# EasyEDA Pro project 声源放大输出(1).eprj

# Schematic Schematic1
Create Date: 2024-07-14; Page Name: P1; Project Name: 声源放大输出(1); Schematic Name: Schematic1; Update Date: 2024-07-15; Company: 嘉立创EDA; Page Size: A4; Version: V1.0
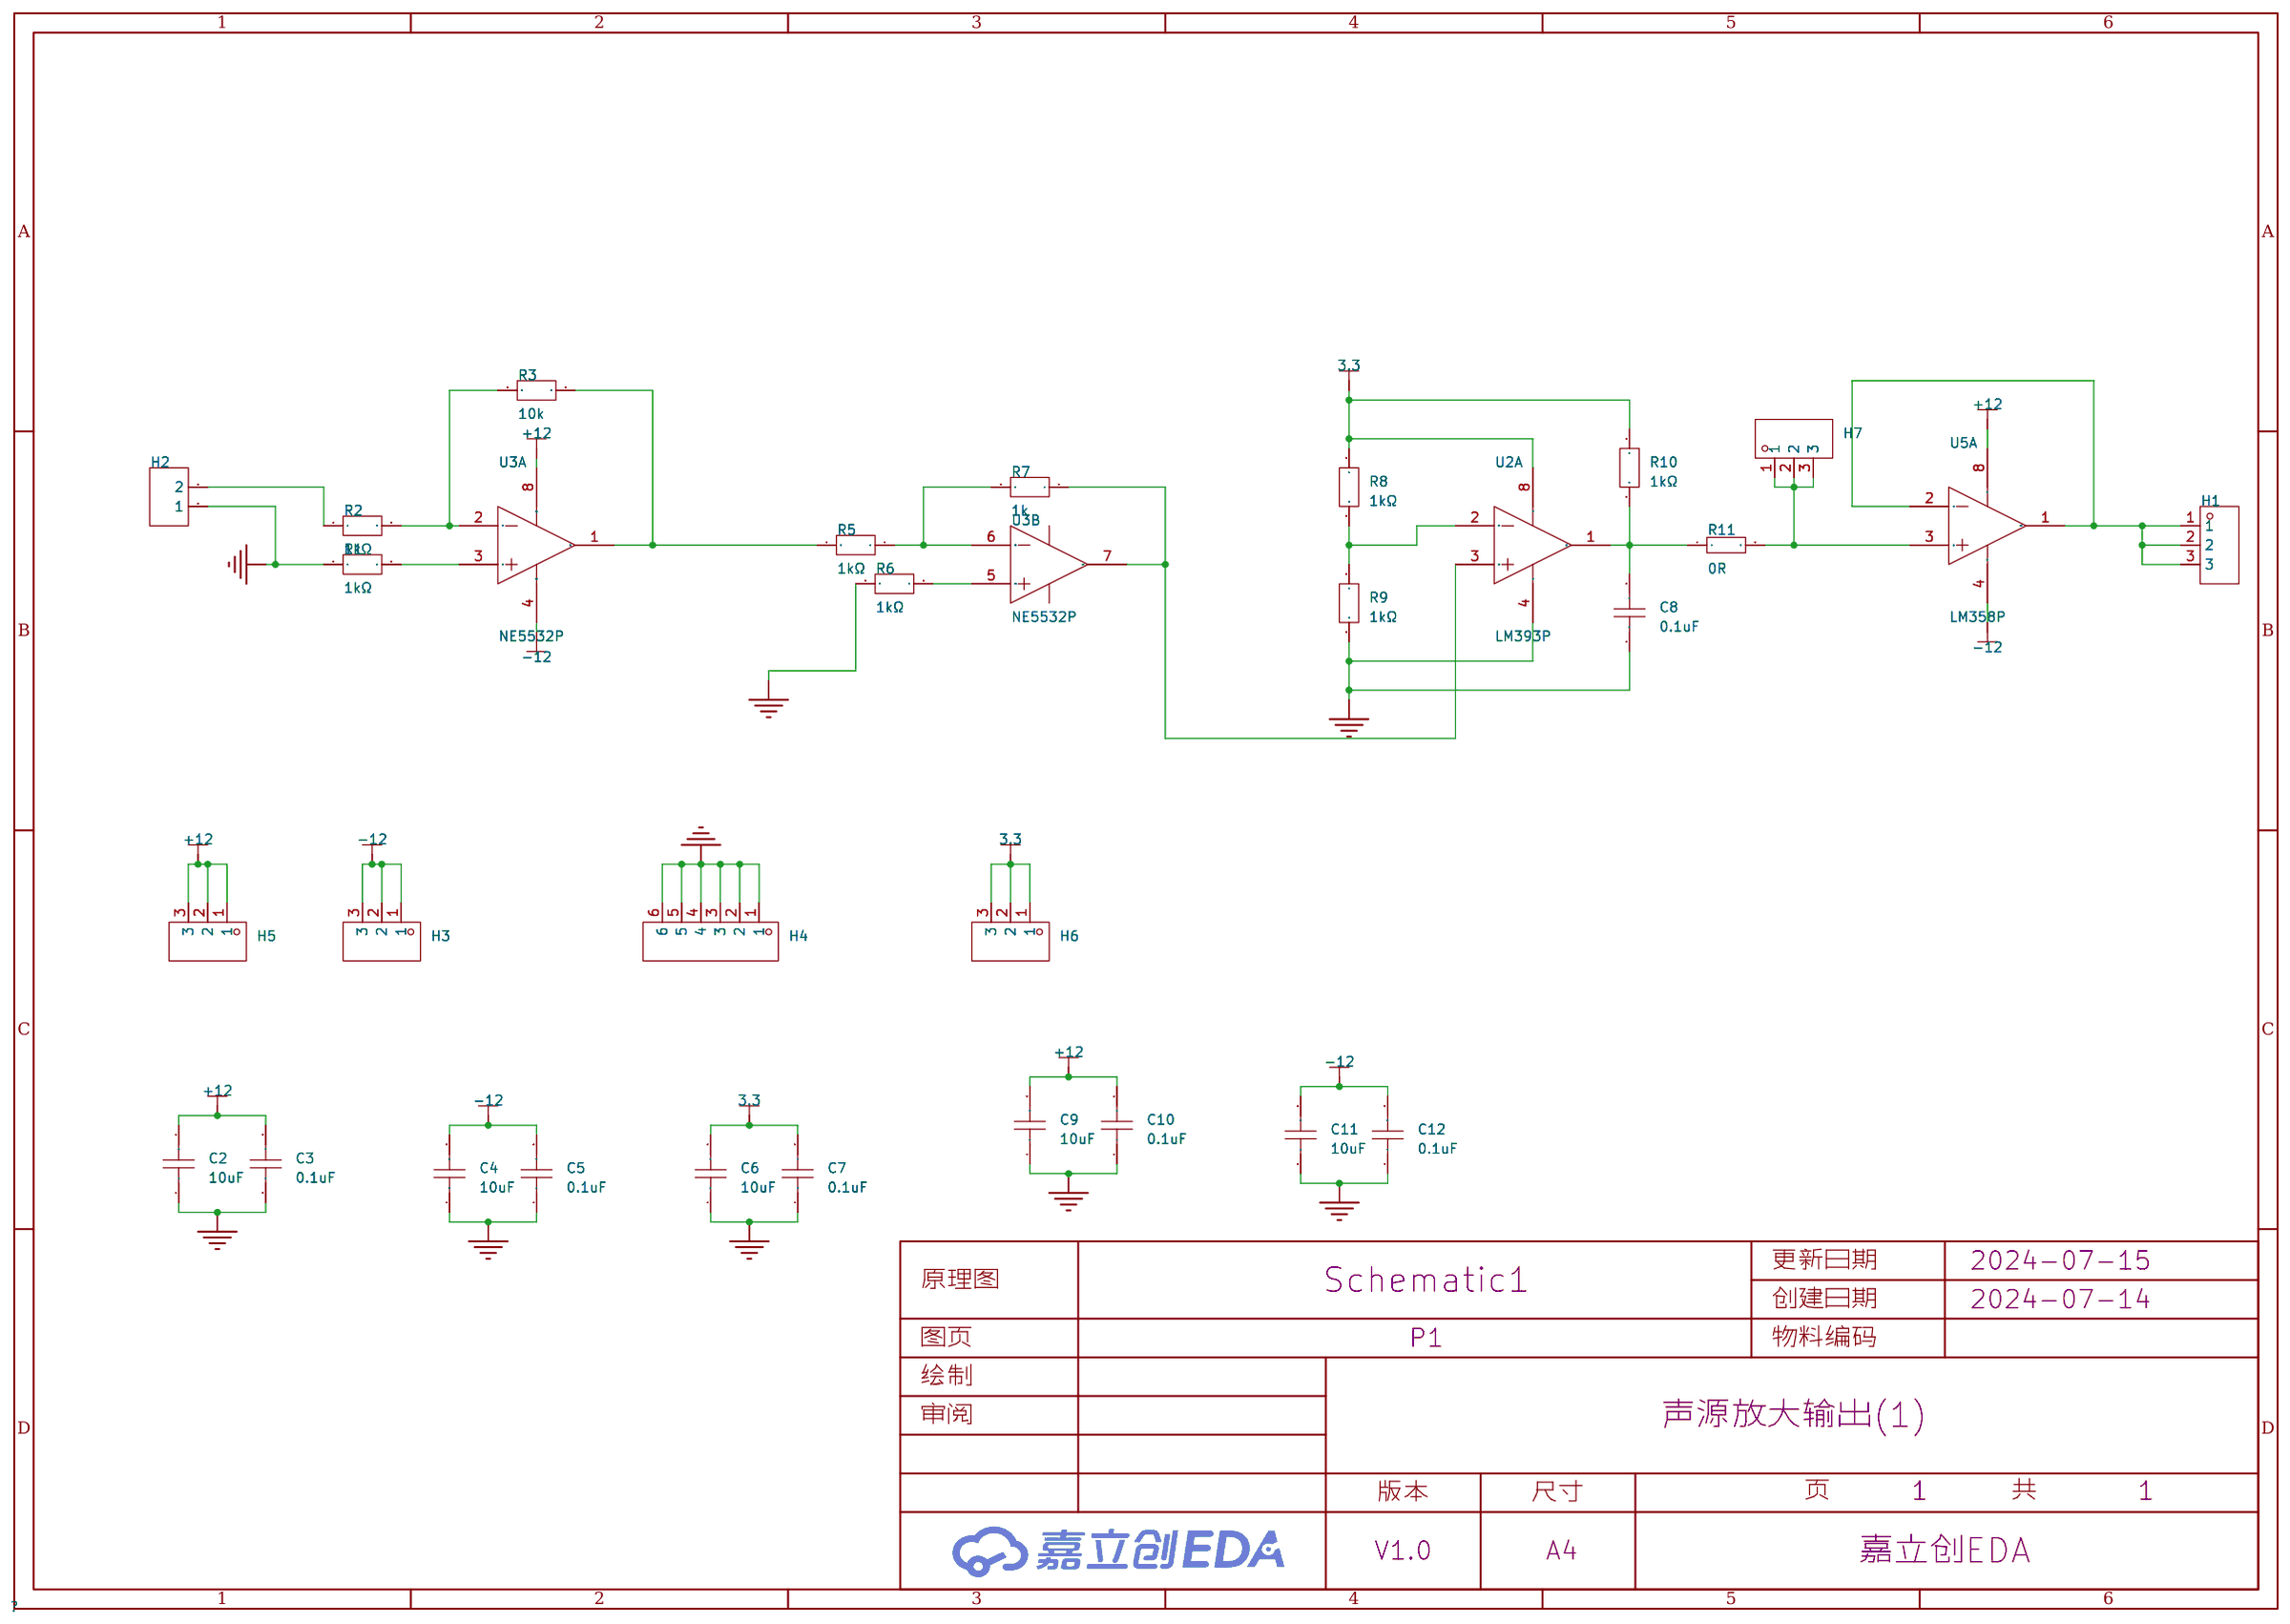
[diagram p0: schematic sheet]

## Parts
C2  10uF  [CAP-TH_L4.2-W3.5-P2.54-D0.5]
C3  0.1uF  [CAP-TH_L4.2-W3.5-P2.54-D0.5]
C4  10uF  [CAP-TH_L4.2-W3.5-P2.54-D0.5]
C5  0.1uF  [CAP-TH_L4.2-W3.5-P2.54-D0.5]
C6  10uF  [CAP-TH_L4.2-W3.5-P2.54-D0.5]
C7  0.1uF  [CAP-TH_L4.2-W3.5-P2.54-D0.5]
C8  0.1uF  [CAP-TH_L4.2-W3.5-P2.54-D0.5]
C9  10uF  [CAP-TH_L4.2-W3.5-P2.54-D0.5]
C10  0.1uF  [CAP-TH_L4.2-W3.5-P2.54-D0.5]
C11  10uF  [CAP-TH_L4.2-W3.5-P2.54-D0.5]
C12  0.1uF  [CAP-TH_L4.2-W3.5-P2.54-D0.5]
H1  -  [HDR-TH_3P-P2.54-V-F]
H2  -  [HDR-TH_2P-P2.54-V-F]
H3  -  [HDR-TH_3P-P2.54-V-F]
H4  -  [HDR-TH_6P-P2.54-V-F]
H5  -  [HDR-TH_3P-P2.54-V-F]
H6  -  [HDR-TH_3P-P2.54-V-F]
H7  -  [HDR-TH_3P-P2.54-V-F]
R1  1kΩ  [RES-TH_BD2.4-L6.3-P10.30-D0.6]
R2  1kΩ  [RES-TH_BD2.4-L6.3-P10.30-D0.6]
R3  10k  [RES-TH_BD2.4-L6.3-P10.30-D0.6]
R5  1kΩ  [RES-TH_BD2.4-L6.3-P10.30-D0.6]
R6  1kΩ  [RES-TH_BD2.4-L6.3-P10.30-D0.6]
R7  1k  [RES-TH_BD2.4-L6.3-P10.30-D0.6]
R8  1kΩ  [RES-TH_BD2.4-L6.3-P10.30-D0.6]
R9  1kΩ  [RES-TH_BD2.4-L6.3-P10.30-D0.6]
R10  1kΩ  [RES-TH_BD2.4-L6.3-P10.30-D0.6]
R11  0R  [Res_1/4W]
U2  LM393P  [DIP-8_L9.7-W6.4-P2.54-LS7.6-BL]  (section 1)
U3  NE5532P  [DIP-8_L9.4-W6.4-P2.54-LS9.1-BL]  (sections 1,2)
U5  LM358P  [DIP-8_L9.7-W6.4-P2.54-LS7.6-BL]  (section 1)

## Library data of the parts
C2-C12 = 178MU0006: 容值:100nF;精度:±10%;额定电压:50V;温度系数:X7R;; LCSC Part Name: 100nF ±10% 50V; Supplier Part: C5632430; Manufacturer: KNSCHA(科尼盛); Supplier Footprint: 插件,P=2.54mm; JLCPCB Part Class: 扩展库; Datasheet: https://atta.szlcsc.com/upload/public/pdf/source/20230506/6B3136079A6D587E863927628E877AC6.pdf; Supplier: LCSC; Tolerance: ±10%; Voltage Rated: 50V; Temperature Coefficient: X7R
H1 H3 H5-H7 = HDR-F_2.54_1x3P: Supplier Part: C541850; Supplier Footprint: 插件
H2 = HDR-F_2.54_1x2P: Supplier Part: C49661; Supplier Footprint: 插件
H4 = HDR-F_2.54_1x6P: Supplier Part: C40877; Supplier Footprint: 插件
R1-R3 R5-R10 = RN1/4W10KFT/BA1: 电阻类型:金属膜电阻;阻值:10kΩ;精度:±1%;功率:250mW;温度系数:±50ppm/℃;; LCSC Part Name: 10kΩ ±1% 250mW 金属膜电阻; Supplier Part: C410695; Manufacturer: Tyohm(幸亚电阻); Supplier Footprint: 插件,D2.4xL6.5mm; JLCPCB Part Class: 扩展库; Datasheet: https://atta.szlcsc.com/upload/public/pdf/source/20190808/C410699_D126E64D28B638F1D73B58E9F61DFD9B.pdf; Supplier: LCSC; Type: 金属膜电阻; Tolerance: ±1%; Overload Voltage (Max): 250V; Power(Watts): 250mW; Temperature Coefficient: ±50ppm/℃; Operating Temperature Range: -55℃~+125℃
R11 = Res_AXIAL-1/4W: Supplier Footprint: 轴向引线
U2 = LM393P_C5355525: Supplier Part: C5355525; Manufacturer: Slkor(萨科微); Supplier Footprint: DIP-8; JLCPCB Part Class: 扩展库; Datasheet: https://atta.szlcsc.com/upload/public/pdf/source/20240105/8B33B918E5DD4527F81D90741F1EF8E9.pdf; Supplier: LCSC
U3 = NE5532P: 放大器数:双路;增益带宽积(GBP):10MHz;输入偏置电流(Ib):200nA;压摆率(SR):9V/us;带宽(-3db):-;; Supplier Part: C5326; Manufacturer: TI(德州仪器); Supplier Footprint: DIP-8; JLCPCB Part Class: 扩展库; Datasheet: https://www.ti.com/cn/lit/gpn/ne5532; Supplier: LCSC; Number of Circuits: 双路; Gain Bandwidth Product(GBP): 10MHz; Current - Input Bias(Ib): 200nA; Slew Rate(SR): 9V/us; Output Current: 38mA; Supply Current: 8mA; Operating Temperature: 0℃~+70℃
U5 = LM358P_C5330384: Supplier Part: C5330384; Manufacturer: Slkor(萨科微); Supplier Footprint: DIP-8; Datasheet: https://atta.szlcsc.com/upload/public/pdf/source/20240105/EDEF03A43059F7E7C713686EC280A486.pdf; Supplier: LCSC

## Nets
GND: C2.1 C3.1 C4.1 C5.1 C6.1 C7.1 C8.1 C9.1 C10.1 C11.1 C12.1 H2.1 H4.1 H4.2 H4.3 H4.4 H4.5 H4.6 R1.1 R6.2 R9.2 U2.4(GND)
3.3: C6.2 C7.2 H6.1 H6.2 H6.3 R8.1 R10.1 U2.8(VCC)
+12: C2.2 C3.2 C9.2 C10.2 H5.1 H5.2 H5.3 U3.8(VCC+) U5.8(VCC)
-12: C4.2 C5.2 C11.2 C12.2 H3.1 H3.2 H3.3 U3.4(VCC-) U5.4(GND)
$1N371: R2.2 R3.1 U3.2(IN1-)
$1N385: R1.2 U3.3(IN1+)
$1N475: R3.2 R5.2 U3.1(OUT1)
$1N583: R6.1 U3.5(IN2+)
$1N646: R5.1 R7.2 U3.6(IN2-)
$1N906: R8.2 R9.1 U2.2(INA-)
$1N917: R7.1 U2.3(INA+) U3.7(OUT2)
$1N1018: H1.1 H1.2 H1.3 U5.1(OUT1) U5.2(IN1-)
$1N1091: H2.2 R2.1
$1N3285: C8.2 R10.2 R11.1 U2.1(OUTA)
$1N3345: H7.1 H7.2 H7.3 R11.2 U5.3(IN1+)

# Board PCB1
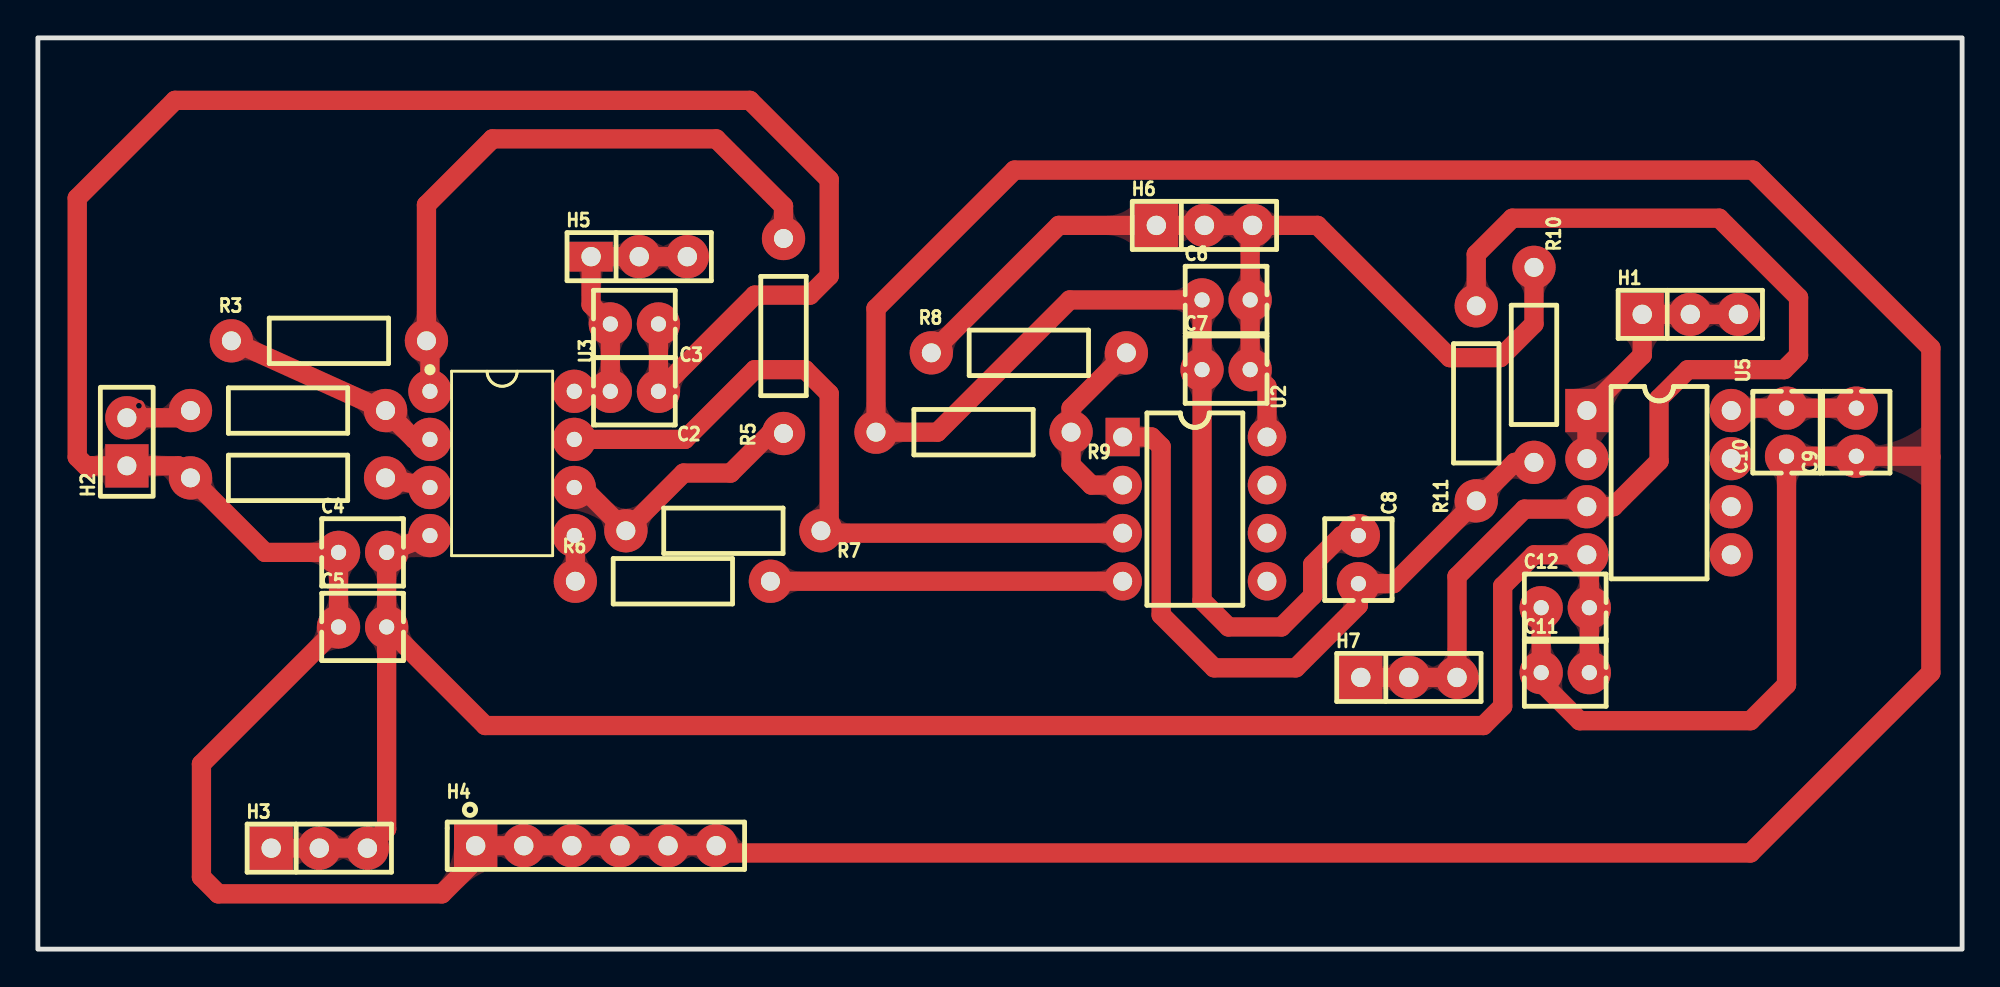
[diagram p1: board, top side]
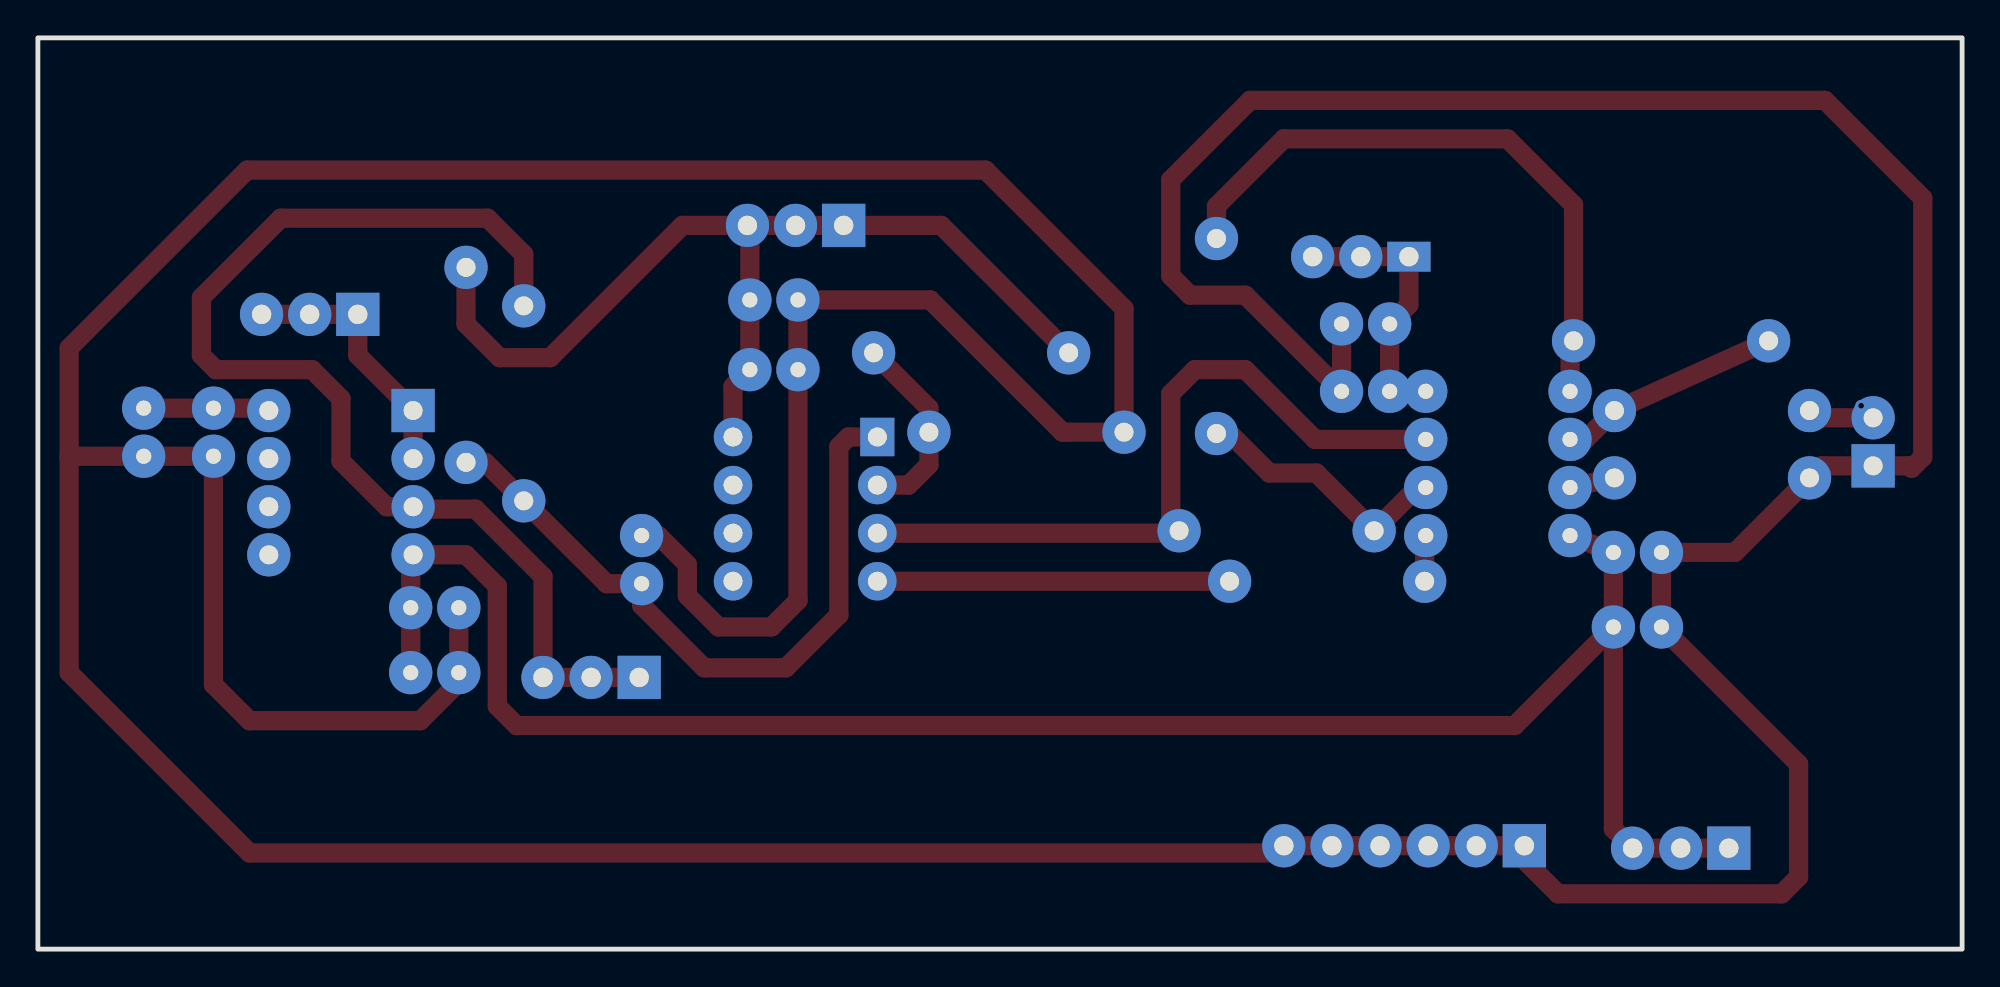
[diagram p2: board, bottom side, seen from below]

Outline 101.6 x 48.13 mm; copper layers: Top Layer, Bottom Layer. Coordinates in mm from the lower left corner of the outline.
Outline path: rectangle 0,48.13 101.6,0
Stack: Top Layer 0.035mm / Dielectric1 1.51mm FR4 er 4.5 / Bottom Layer 0.035mm

## Design rules (mm)
template: JLCPCB Capability(Two Layers Board)
spacing copperThickness1oz (default): track to track 0.102, other pairs 0.152 to 0.3
spacing copperThickness2oz: track to track 0.203, other pairs 0.152 to 0.3
track width copperThickness1oz (default): min 0.127, default 0.254, max 2.54
track width copperThickness2oz: min 0.203, default 0.254, max 2.54
differential pair differentialPair (default): width min 0.127, default 0.254, max 2.54; gap min 0.152, default 0.152
via viaSize (default): diameter min 0.5, default 0.61, max 10; hole min 0.3, default 0.305, max 6.3

## Placement (name value [footprint] x y rotation side)
C2  10uF  [cap-th_l4.2-w3.5-p2.54-d0.5]  31.5 29.46 180 top
C3  0.1uF  [cap-th_l4.2-w3.5-p2.54-d0.5]  31.5 33.02 180 top
C4  10uF  [cap-th_l4.2-w3.5-p2.54-d0.5]  17.14 20.96 0 top
C5  0.1uF  [cap-th_l4.2-w3.5-p2.54-d0.5]  17.14 17.02 0 top
C6  10uF  [cap-th_l4.2-w3.5-p2.54-d0.5]  62.74 34.29 0 top
C7  0.1uF  [cap-th_l4.2-w3.5-p2.54-d0.5]  62.74 30.61 0 top
C8  0.1uF  [cap-th_l4.2-w3.5-p2.54-d0.5]  69.72 20.57 270 top
C9  10uF  [cap-th_l4.2-w3.5-p2.54-d0.5]  96.01 27.31 90 top
C10  0.1uF  [cap-th_l4.2-w3.5-p2.54-d0.5]  92.33 27.31 90 top
C11  10uF  [cap-th_l4.2-w3.5-p2.54-d0.5]  80.64 14.61 0 top
C12  0.1uF  [cap-th_l4.2-w3.5-p2.54-d0.5]  80.64 18.03 0 top
H1  -  [hdr-th_3p-p2.54-v-f#2]  87.25 33.53 0 top
H2  -  [hdr-th_2p-p2.54-v-f]  4.7 26.8 90 top
H3  -  [hdr-th_3p-p2.54-v-f#2]  14.86 5.33 0 top
H4  -  [hdr-th_6p-p2.54-v-f]  29.46 5.46 0 top
H5  -  [hdr-th_3p-p2.54-v-f]  31.75 36.58 0 top
H6  -  [hdr-th_3p-p2.54-v-f#2]  61.59 38.23 0 top
H7  -  [hdr-th_3p-p2.54-v-f#2]  72.39 14.35 0 top
R1  1kΩ  [res-th_bd2.4-l6.3-p10.30-d0.6]  13.21 24.89 0 top
R2  1kΩ  [res-th_bd2.4-l6.3-p10.30-d0.6]  13.21 28.45 0 top
R3  10k  [res-th_bd2.4-l6.3-p10.30-d0.6]  15.37 32.13 0 top
R5  1kΩ  [res-th_bd2.4-l6.3-p10.30-d0.6]  39.37 32.39 90 top
R6  1kΩ  [res-th_bd2.4-l6.3-p10.30-d0.6]  33.53 19.43 0 top
R7  1k  [res-th_bd2.4-l6.3-p10.30-d0.6]  36.2 22.1 180 top
R8  1kΩ  [res-th_bd2.4-l6.3-p10.30-d0.6]  52.32 31.5 0 top
R9  1kΩ  [res-th_bd2.4-l6.3-p10.30-d0.6]  49.4 27.31 180 top
R10  1kΩ  [res-th_bd2.4-l6.3-p10.30-d0.6]  78.99 30.86 270 top
R11  0R  [res_1/4w]  75.95 28.83 90 top
U2  LM393P  [dip-8_l9.7-w6.4-p2.54-ls7.6-bl#2]  61.09 23.24 270 top
U3  NE5532P  [dip-8_l9.4-w6.4-p2.54-ls9.1-bl]  24.51 25.65 270 top
U5  LM358P  [dip-8_l9.7-w6.4-p2.54-ls7.6-bl]  85.6 24.64 270 top

## Footprints (pads in the part's own frame, mm; a bottom-side part is the same pattern mirrored in y, then rotated)
cap-th_l4.2-w3.5-p2.54-d0.5
  round 2.286 hole 0.8: 1(-1.27,0) 2(1.27,0)
dip-8_l9.4-w6.4-p2.54-ls9.1-bl
  oval 2.286x2.286 hole 0.8: 1(-3.81,-3.81) 2(-1.27,-3.81) 3(1.27,-3.81) 4(3.81,-3.81) 5(3.81,3.81) 6(1.27,3.81) 7(-1.27,3.81) 8(-3.81,3.81)
dip-8_l9.7-w6.4-p2.54-ls7.6-bl
  rect 2.286x2.286 hole 1: 1(-3.81,-3.81)
  round 2.286 hole 1: 2(-1.27,-3.81) 3(1.27,-3.81) 4(3.81,-3.81) 5(3.81,3.81) 6(1.27,3.81) 7(-1.27,3.81) 8(-3.81,3.81)
dip-8_l9.7-w6.4-p2.54-ls7.6-bl#2
  rect 2.032x1.8 hole 1: 1(-3.81,-3.81)
  round 2.032 hole 1: 2(-1.27,-3.81) 3(1.27,-3.81) 4(3.81,-3.81) 5(3.81,3.81) 6(1.27,3.81) 7(-1.27,3.81) 8(-3.81,3.81)
hdr-th_2p-p2.54-v-f
  rect 2.286x2.286 hole 1: 1(-1.27,0)
  round 2.286 hole 1: 2(1.27,0)
hdr-th_3p-p2.54-v-f
  rect 2.286x1.575 hole 1.02: 1(-2.54,0)
  round 2.286 hole 1.02: 2(0,0) 3(2.54,0)
hdr-th_3p-p2.54-v-f#2
  rect 2.286x2.286 hole 1.02: 1(-2.54,0)
  round 2.286 hole 1.02: 2(0,0) 3(2.54,0)
hdr-th_6p-p2.54-v-f
  rect 2.286x2.286 hole 1.02: 1(-6.35,0)
  round 2.286 hole 1.02: 2(-3.81,0) 3(-1.27,0) 4(1.27,0) 5(3.81,0) 6(6.35,0)
res-th_bd2.4-l6.3-p10.30-d0.6
  round 2.286 hole 1: 1(-5.15,0) 2(5.15,0)
res_1/4w
  round 2.286 hole 1: 1(-5.15,0) 2(5.15,0)

## Nets
As in the schematic.

Pads without a net: U2 5 6 7; U5 5 6 7

## Via types
v1: diameter 0.61, hole 0.305, Top Layer to Bottom Layer, 1 via

## Routing (per net, layer and track width the routed paths; a pad name or vN(x,y) marks a point on that pad's centre or on a via; arc(x,y) is an arc through that point)
GND: length 402.1
  Top Layer w1.016: C3.1 C2.1 37.85,34.54 40.77,34.54 41.78,35.56 41.78,40.64 37.59,44.83 7.24,44.83 2.08,39.67 2.08,25.99 2.67,25.4 2.79,25.53 H2.1 7.42,25.53 R1.1 12,20.96 C4.1 C5.1 8.64,9.78 8.64,3.81 9.52,2.92 21.34,2.92 23.11,4.7 H4.1 H4.2 H4.3 H4.4 H4.5 H4.6 36.2,5.08 90.42,5.08 99.95,14.61 99.95,26 ; 99.95,26 99.91,26.04 C9.1 C10.1 92.33,13.97 90.42,12.07 81.41,12.07 79.37,14.1 C11.1 C12.1 ; 99.95,26 99.95,31.75 90.55,41.15 51.56,41.15 44.25,33.84 R9.2 47.5,27.31 54.48,34.29 C6.1 C7.1 61.47,18.42 62.86,17.02 65.66,17.02 67.31,18.67 67.31,20.32 68.83,21.84 C8.1 ; R6.2 U2.4 57.28,19.3 57.15,19.18
3.3: length 52.8
  Top Layer w1.016: H6.3 67.56,38.23 74.55,31.24 77.22,31.24 78.99,33.02 R10.1 ; H6.3 H6.2 H6.1 53.9,38.23 R8.1 ; H6.3 64.01,38.1 C6.2 C7.2 64.9,29.72 U2.8
+12: length 21.2
  Top Layer w1.016: U5.8 89.54,28.58 C10.2 C9.2 ; U3.8 C2.2 C3.2 29.21,34.04 H5.1 H5.2 H5.3
-12: length 102.8
  Top Layer w1.016: C11.2 C12.2 81.92,20.7 U5.4 78.99,20.83 77.34,19.18 77.34,12.83 76.33,11.81 23.62,11.81 C5.2 ; C5.2 18.41,6.35 H3.3 H3.2 H3.1 ; C5.2 C4.2 U3.4
$1N371: length 11.9
  Top Layer w1.016: U3.2 19.88,26.92 R2.2 R3.1
$1N385: length 2.4
  Top Layer w1.016: U3.3 R1.2
$1N475: length 33.4
  Top Layer w1.016: R5.2 39.37,39.24 35.81,42.8 24,42.8 20.52,39.31 R3.2 20.7,31.95 U3.1
$1N583: length 2.4
  Top Layer w1.016: R6.1 28.38,21.79 U3.5
$1N646: length 14.1
  Top Layer w1.016: 39.37,27.24 38.67,27.24 36.58,25.15 34.09,25.15 R7.2 28.76,24.38 U3.6
$1N906: length 10.3
  Top Layer w1.016: R8.2 54.55,28.58 R9.1 54.55,25.58 55.63,24.51 U2.2
$1N917: length 38.9
  Top Layer w1.016: U3.7 34.16,26.92 37.85,30.61 40.51,30.61 41.78,29.34 41.78,22.54 R7.1 41.47,21.97 U2.3
$1N1018: length 13.9
  Top Layer w1.016: H1.3 H1.2 H1.1 84.71,31.37 U5.1 U5.2
$1N1091: length 3.6
  Top Layer w1.016: 8.06,28.7 7.42,28.07 H2.2
  vias: v1(5.33,28.7)
$1N3285: length 37.1
  Top Layer w1.016: 78.99,25.71 77.98,25.71 R11.1 71.57,19.3 C8.2 69.72,18.16 66.42,14.86 62.1,14.86 59.31,17.65 59.31,26.54 58.8,27.05 U2.1
$1N3345: length 60.5
  Top Layer w1.016: H7.1 H7.2 H7.3 74.93,19.69 78.49,23.24 81.66,23.24 U5.3 83.18,23.37 85.6,25.78 85.6,29.08 87.12,30.61 92.2,30.61 92.96,31.37 92.96,34.42 88.77,38.61 77.85,38.61 75.95,36.7 R11.2

Small or netless copper shapes (teardrops, artwork), in the pictures only: 154 on Top Layer
